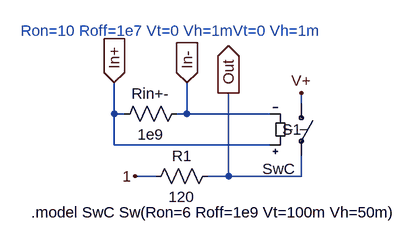
[diagram p0: schematic CpSw.asc]
CpSw.asc, the LTspice schematic file:
Version 4
SHEET 1 880 680
WIRE 0 256 0 208
WIRE 0 304 0 256
WIRE 16 256 0 256
WIRE 64 352 32 352
WIRE 112 256 96 256
WIRE 112 256 112 208
WIRE 176 352 144 352
WIRE 176 352 176 224
WIRE 240 256 112 256
WIRE 240 304 0 304
WIRE 288 240 288 224
WIRE 288 352 176 352
WIRE 288 352 288 320
FLAG 0 208 In+
IOPIN 0 208 In
FLAG 112 208 In-
IOPIN 112 208 In
FLAG 176 224 Out
IOPIN 176 224 Out
FLAG 288 224 V+
FLAG 32 352 1
SYMBOL sw 288 224 R0
WINDOW 0 -29 56 Left 0
WINDOW 3 -60 117 Left 0
SYMATTR InstName S1
SYMATTR Value SwC
SYMBOL res 112 240 R90
WINDOW 0 0 56 VBottom 0
WINDOW 3 32 56 VTop 0
SYMATTR InstName Rin+-
SYMATTR Value 1e9
SYMBOL res 160 336 R90
WINDOW 0 0 56 VBottom 0
WINDOW 3 32 56 VTop 0
SYMATTR InstName R1
SYMATTR Value 120
TEXT -144 128 Left 0 ;Ron=10 Roff=1e7 Vt=0 Vh=1mVt=0 Vh=1m
TEXT -128 408 Left 0 !.model SwC Sw(Ron=6 Roff=1e9 Vt=100m Vh=50m)

The netlist it stands for:
* CpSw.asc
S1 V+ Out In+ In- SwC
Rin+- In- In+ 1e9
R1 Out 1 120
* Ron=10 Roff=1e7 Vt=0 Vh=1mVt=0 Vh=1m
.model SwC Sw(Ron=6 Roff=1e9 Vt=100m Vh=50m)
.backanno
.end